# Altium schematic sheet RTDS.SchDoc
size A4
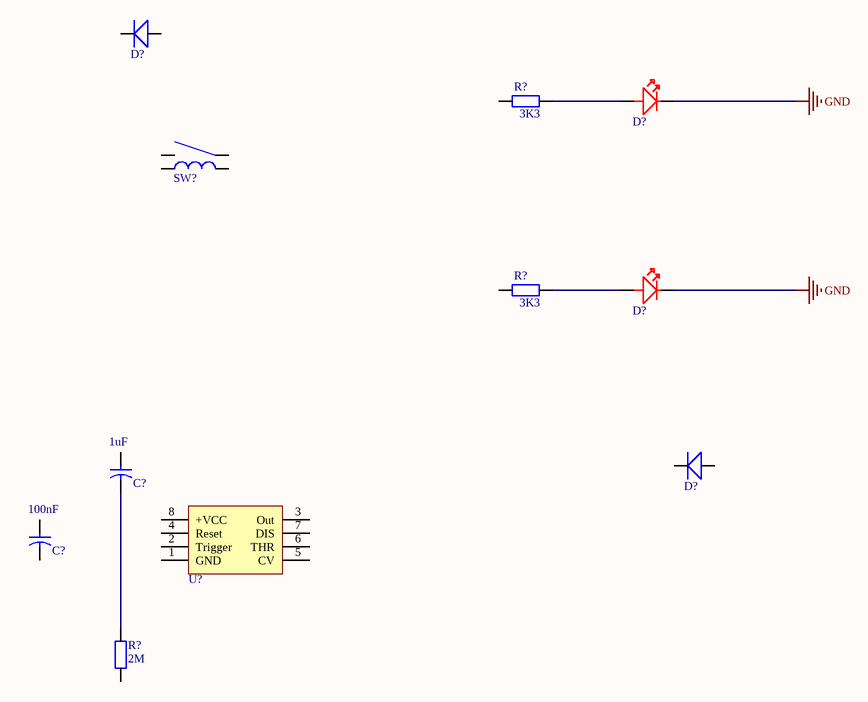
[diagram p0: RTDS.SchDoc]

## Parts
(Parts that share a designator on the sheet are numbered #1, #2 ... from top to bottom, then left to right.)
C?#1  1uF  [CAPAE430X610D540L170X65N]
C?#2  100nF  [CAPAE430X610D540L170X65N]
D?#1  MMDL6050T1G  [SOD250X125X100L13X32N]  (value not drawn)
D?#2  Red LED  [LEDC160X80X50L30N]  (value not drawn)
D?#3  Red LED  [LEDC160X80X50L30N]  (value not drawn)
D?#4  MMDL6050T1G  [SOD250X125X100L13X32N]  (value not drawn)
R?#1  3K3  [RESC160X80X50L30N]
R?#2  3K3  [RESC160X80X50L30N]
R?#3  2M  [RESC160X80X50L30N]
SW?  SPST-NO  [655414191282]  (value not drawn)
U?  LM555CMX  [SOIC8P127_490X599X175L104X41N]  (value not drawn)

## Nets
GND: D?#2.C D?#3.C
NetC?#1_2: C?#1.2 R?#3.2
NetD?#2_A: D?#2.A R?#1.2
NetD?#3_A: D?#3.A R?#2.2

Not connected (* = marked no-connect by the designer): C?#1 1; C?#2 1 2; D?#1 A C(2); D?#4 A C(2); R?#1 1; R?#2 1; R?#3 1; SW? 1 2 3 4; U? 1(GND) 2(Trigger) 3(Out) 4(Reset) 5(CV) 6(THR) 7(DIS) 8(+VCC)

## Library data of the parts
C?#1 C?#2 = C_10uF_50V: Manufacturer Part Number: EEE-FK1H100SR; Voltage Rating: 50V; Capacitor Case Style: B; ComponentLinkDescription: Datasheet; FR_SN: C_P-01; Part Number: C_10uF_50V; ComponentLinkURL: https://hr.mouser.com/datasheet/2/315/ABA0000C1251-1138508.pdf; Supplier Part Number: 667-EEE-FK1H100SR
  C?#1: Value: 1uF
  C?#2: Value: 100nF
D?#1 D?#4 = MMDL6050T1G: Max Reverse Voltage: 70V; Diode Type: Rectifier; Diode Case Style: SOD-323; Reverse Recovery Time: 4ns; Forward Current: 200 mA; ComponentLinkDescription: Datasheet; FR_SN: D-01; Part Number: MMDL6050T1G; Value: MMDL6050T1G; Manufacturer Part Number: MMDL6050T1G; ComponentLinkURL: https://hr.mouser.com/datasheet/2/308/MMDL6050T1-D-1811964.pdf; Supplier Part Number: 863-MMDL6050T1G
D?#2 D?#3 = LED_Red_60mcd: Manufacturer Part Number: 150060SS75000; Max Reverse Voltage: 5V; Diode Case Style: 0603; Forward Current: 20mA; ComponentLinkDescription: Datasheet; FR_SN: D_LED-03; Part Number: LED_Red_60mcd; Value: Red LED; Diode Type: LED; ComponentLinkURL: https://hr.mouser.com/datasheet/2/445/150060SS75000-368982.pdf; Supplier Part Number: 710-150060SS75000
R?#1-R?#3 = R_0603_1K_0W1: Manufacturer Part Number: CRCW06031K00FKEAC; Power Rating: 100mW; Resistor Case Style: 0603; Temperature Coefficient: 100 PPM / C; FR_SN: R-01; Part Number: R_0603_1K_0W1; ComponentLink1URL: https://hr.mouser.com/ProductDetail/Vishay/CRCW06031K00FKEAC?qs=sGAEpiMZZMtlubZbdhIBIIZe04wfiaJW%2fzoax%252b8jFdk%3d; ComponentLink1Description: Datasheet; Supplier Part Number: 71-CRCW06031K00FKEAC
  R?#1 R?#2: Value: 3K3
  R?#3: Value: 2M
SW? = Relay_Non-L_TH: Manufacturer Part Number: 4-1419128-2; Switch Case Style: Relay; ComponentLinkDescription: Datasheet; FR_SN: SW-03; Part Number: Relay_Non-L_TH; Value: SPST-NO; Type: Non-Latching; Configuration: SPST-NO; ComponentLinkURL: https://www.te.com/commerce/DocumentDelivery/DDEController?Action=srchrtrv&DocNm=1461104&DocType=Customer+Drawing&DocLang=English&PartCntxt=4-1419128-2&DocFormat=pdf; Supplier Part Number: 655-4-1419128-2
U? = LM555: Manufacturer Part Number: LM555CMX/NOPB; IC Case Style: SOIC-8; ComponentLinkDescription: Datasheet; FR_SN: IC_Misc-09; Part Number: LM555; Value: LM555CMX; Category: Clock & Timer ICs; ComponentLinkURL: http://www.ti.com/lit/ds/symlink/lm555.pdf; Supplier Part Number: 926-LM555CMX/NOPB